# EAGLE design main (EAGLE 8.4.0)
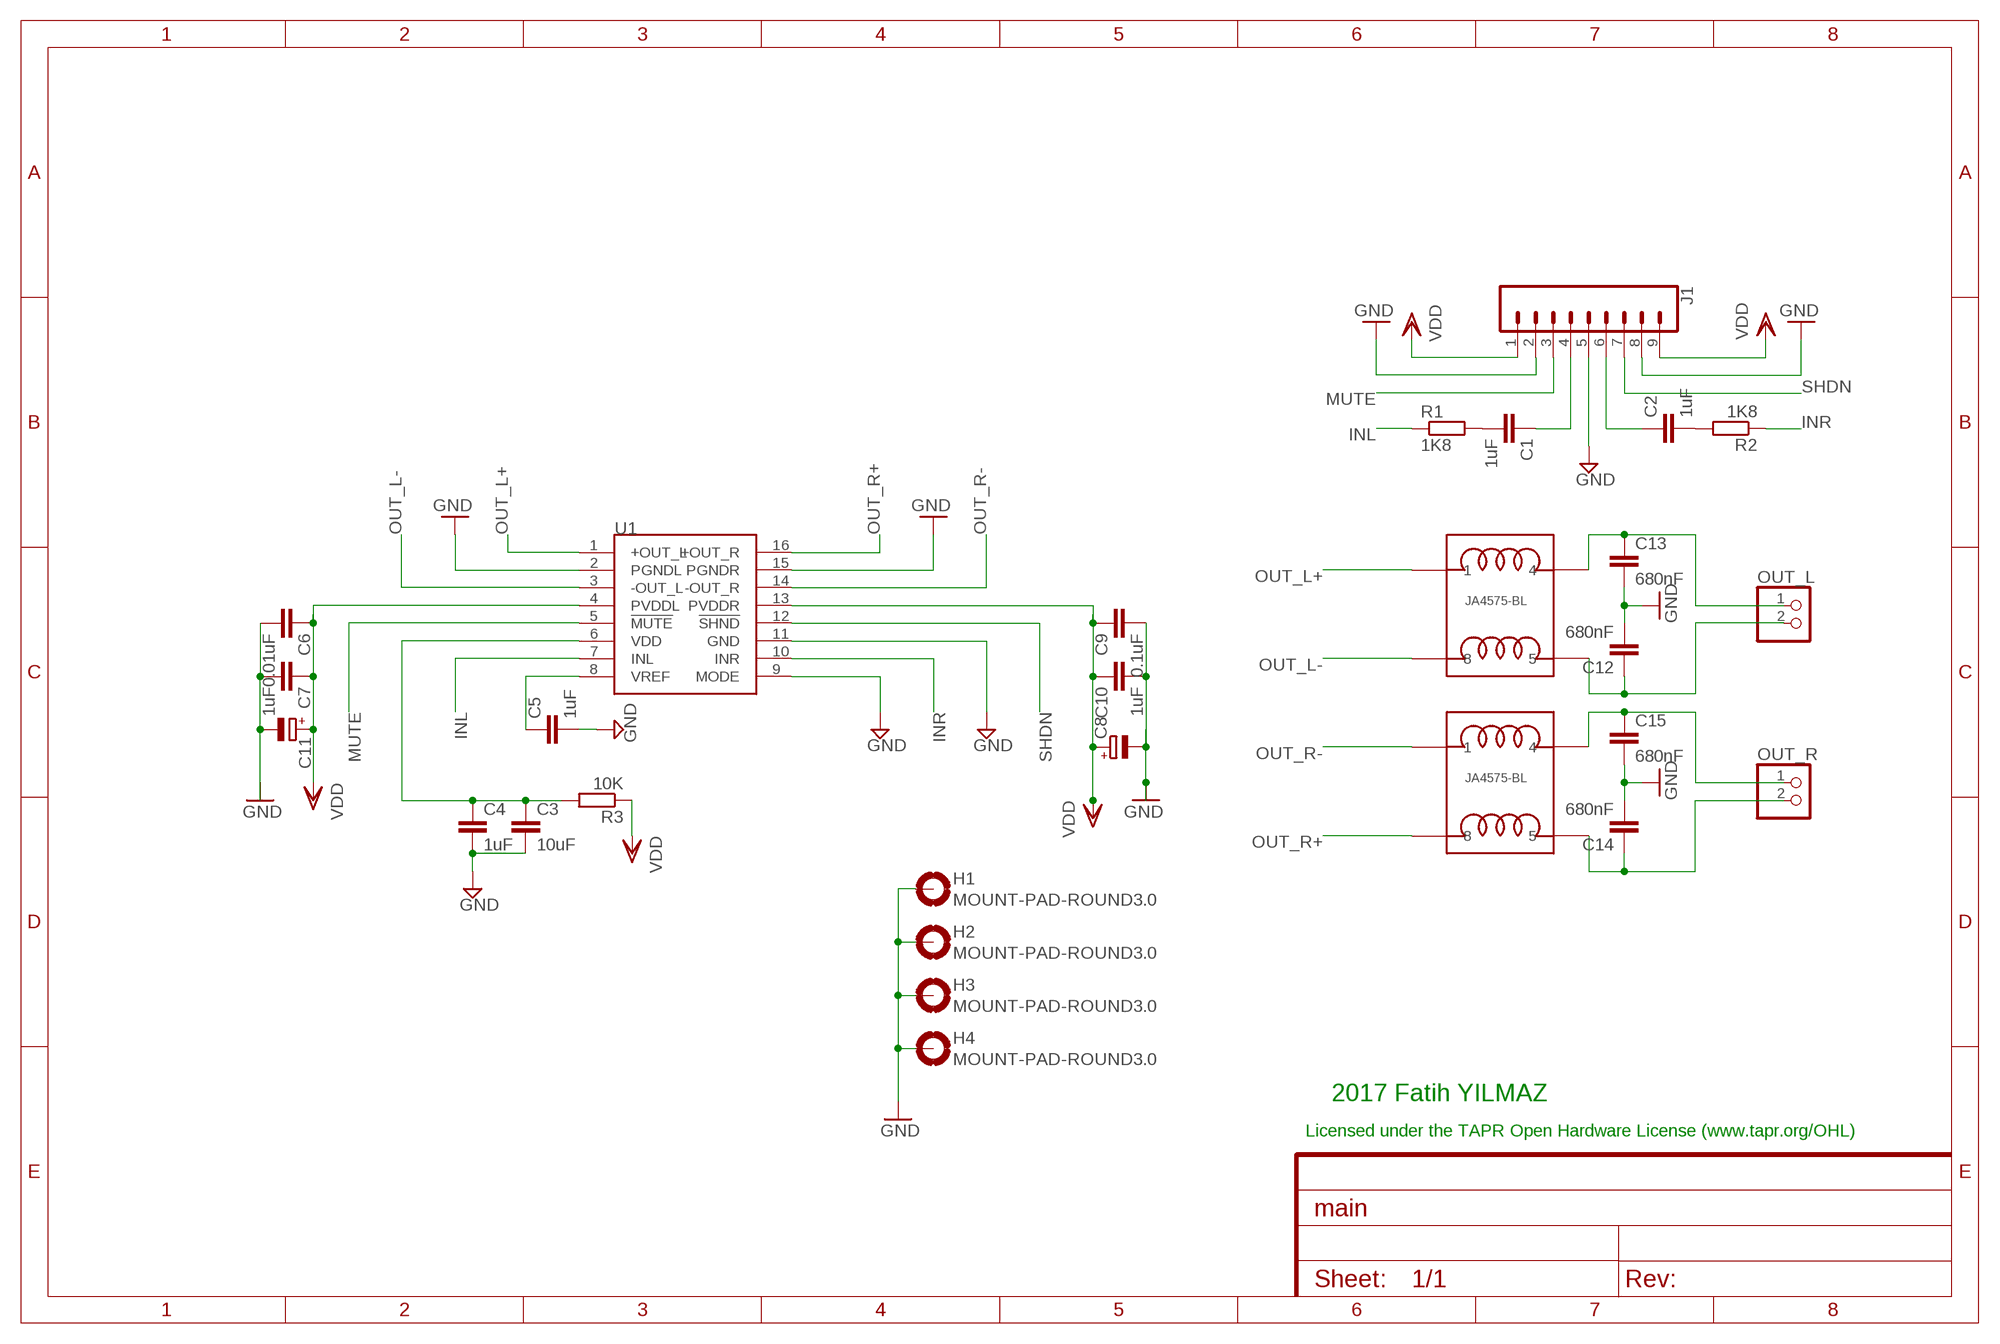
[diagram p0: schematic, sheet 1]
FRAME1 (FRAME-A4L): CNAME: PAM8406_25CM2; CREVISION: REV2; DESIGNER: Fatih YILMAZ

## Parts
C1  1uF  C-EUC1206  [C1206]
C2  1uF  C-EUC1206  [C1206]
C3  10uF  C-EUC1206  [C1206]
C4  1uF  C-EUC1206  [C1206]
C5  1uF  C-EUC1206  [C1206]
C6  0.01uF  C-EUC1206  [C1206]
C7  1uF  C-EUC1206  [C1206]
C8  CPOL-EUE3.5-8  [E3,5-8]
C9  0.1uF  C-EUC1206  [C1206]
C10  1uF  C-EUC1206  [C1206]
C11  CPOL-EUE3.5-8  [E3,5-8]
C12  680nF  C-EU050-045X075  [C050-045X075]
C13  680nF  C-EU050-045X075  [C050-045X075]
C14  680nF  C-EU050-045X075  [C050-045X075]
C15  680nF  C-EU050-045X075  [C050-045X075]
H1  MOUNT-PAD-ROUND3.0  [3,0-PAD]
H2  MOUNT-PAD-ROUND3.0  [3,0-PAD]
H3  MOUNT-PAD-ROUND3.0  [3,0-PAD]
H4  MOUNT-PAD-ROUND3.0  [3,0-PAD]
J1  CONN_09NO_SILK  [1X09_NO_SILK]
LEFT_COIL  JA4575-BL  [JA4575-BL]
OUT_L  PINHD-1X2  [1X02]
OUT_R  PINHD-1X2  [1X02]
R1  1K8  R-EU_R1206  [R1206]
R2  1K8  R-EU_R1206  [R1206]
R3  10K  R-EU_R1206  [R1206]
RIGHT_COIL  JA4575-BL  [JA4575-BL]
U1  PAM8403  [SOP-16]

## Nets
AVDD: C3.1 C4.1 R3.2 U1.6(VDD)
GND: C3.2 C4.2 C5.2 C6.2 C7.2 C8.- C9.2 C10.2 C11.- C12.2 C13.2 C14.2 C15.2 H1.B3,0(MOUNT) H2.B3,0(MOUNT) H3.B3,0(MOUNT) H4.B3,0(MOUNT) J1.2 J1.5 J1.8 U1.2(PGNDL) U1.9(MODE) U1.11(GND) U1.15(PGNDR)
INL: R1.1 U1.7(INL)
INR: R2.1 U1.10(INR)
MUTE: J1.3 U1.5(!MUTE)
N$1: C1.2 R1.2
N$2: C2.2 R2.2
N$3: C1.1 J1.4
N$4: C13.1 LEFT_COIL.4 OUT_L.1
N$5: C2.1 J1.6
N$6: C15.1 OUT_R.1 RIGHT_COIL.4
N$7: C14.1 OUT_R.2 RIGHT_COIL.5
N$8: C12.1 LEFT_COIL.5 OUT_L.2
OUT_L+: LEFT_COIL.1 U1.1(+OUT_L)
OUT_L-: LEFT_COIL.8 U1.3(-OUT_L)
OUT_R+: RIGHT_COIL.8 U1.16(+OUT_R)
OUT_R-: RIGHT_COIL.1 U1.14(-OUT_R)
SHDN: J1.7 U1.12(!SHND)
VDD: C6.1 C7.1 C8.+ C9.1 C10.1 C11.+ J1.1 J1.9 R3.1 U1.4(PVDDL) U1.13(PVDDR)
VREF: C5.1 U1.8(VREF)

## Notes on the sheet
- Ⓒ 2017 Fatih YILMAZ
- Licensed under the TAPR Open Hardware License (www.tapr.org/OHL)

## Library data of the parts
C1 C2 = rcl:C-EU: CAPACITOR, European symbol; MPN: C0603C105K4PACTU
C3-C7 C9 C10 C12-C15 = rcl:C-EU: CAPACITOR, European symbol
C8 C11 = rcl:CPOL-EU: POLARIZED CAPACITOR, European symbol
H1-H4 = holes:MOUNT-PAD-ROUND: MOUNTING PAD, round
J1 = SparkFun-Connectors:CONN_09: Multi connection point. Often used as Generic Header-pin footprint for 0.1 inch spaced/style header connections On any of the 0.1 inch spaced packages, you can populate with these: Break Away Headers - Straight <https://www.sparkfun.com/products/116> (PRT-00116) Break Away Male Headers - Right Angle <https://www.sparkfun.com/products/553> (PRT-00553) Female Headers <https://www.sparkfun.com/products/115> (PRT-00115) Break Away Headers - Machine Pin <https://www.sparkfun.com/products/117> (PRT-00117) Break Away Female Headers - Swiss Machine Pin <https://www.sparkfun.com/products/743> (PRT-00743) For SCREWTERMINALS and SPRING TERMINALS visit here: Screw Terimnals on SparkFun.com <https://www.sparkfun.com/search/results?term=Screw+Terminals> (5mm/3.5mm/2.54mm spacing) This device is also useful as a general connection point to wire up your design to another part of your project. Our various solder wires solder well into these plated through hole pads. Hook-Up Wire - Assortment (Stranded, 22 AWG) <https://www.sparkfun.com/products/11375> (PRT-11375) Hook-Up Wire - Assortment (Solid Core, 22 AWG) <https://www.sparkfun.com/products/11367> (PRT-11367) View the entire wire category on our website here <https://www.sparkfun.com/categories/141> Special notes: Molex polarized connector foot print use with SKU : PRT-08231 with associated crimp pins and housings. 1MM SMD Version SKU: PRT-10208 NOTES ON THE VARIANTS LOCK and LOCK_LONGPADS... This footprint was designed to help hold the alignment of a through-hole component (i.e. 6-pin header) while soldering it into place. You may notice that each hole has been shifted either up or down by 0.005 of an inch from it's more standard position (which is a perfectly straight line). This slight alteration caused the pins (the squares in the middle) to touch the edges of the holes. Because they are alternating, it causes a "brace" to hold the component in place. 0.005 has proven to be the perfect amount of "off-center" position when using our standard breakaway headers. Although looks a little odd when you look at the bare footprint, once you have a header in there, the alteration is very hard to notice. Also,if you push a header all the way into place, it is covered up entirely on the bottom side.
LEFT_COIL RIGHT_COIL = JA4575-BL:JA4575-BL
OUT_L OUT_R = pinhead:PINHD-1X2: PIN HEADER
R1-R3 = rcl:R-EU_: RESISTOR, European symbol
U1 = PAM8403:PAM8403: Dual channel audio amplifier IC - PAM8403

## Board
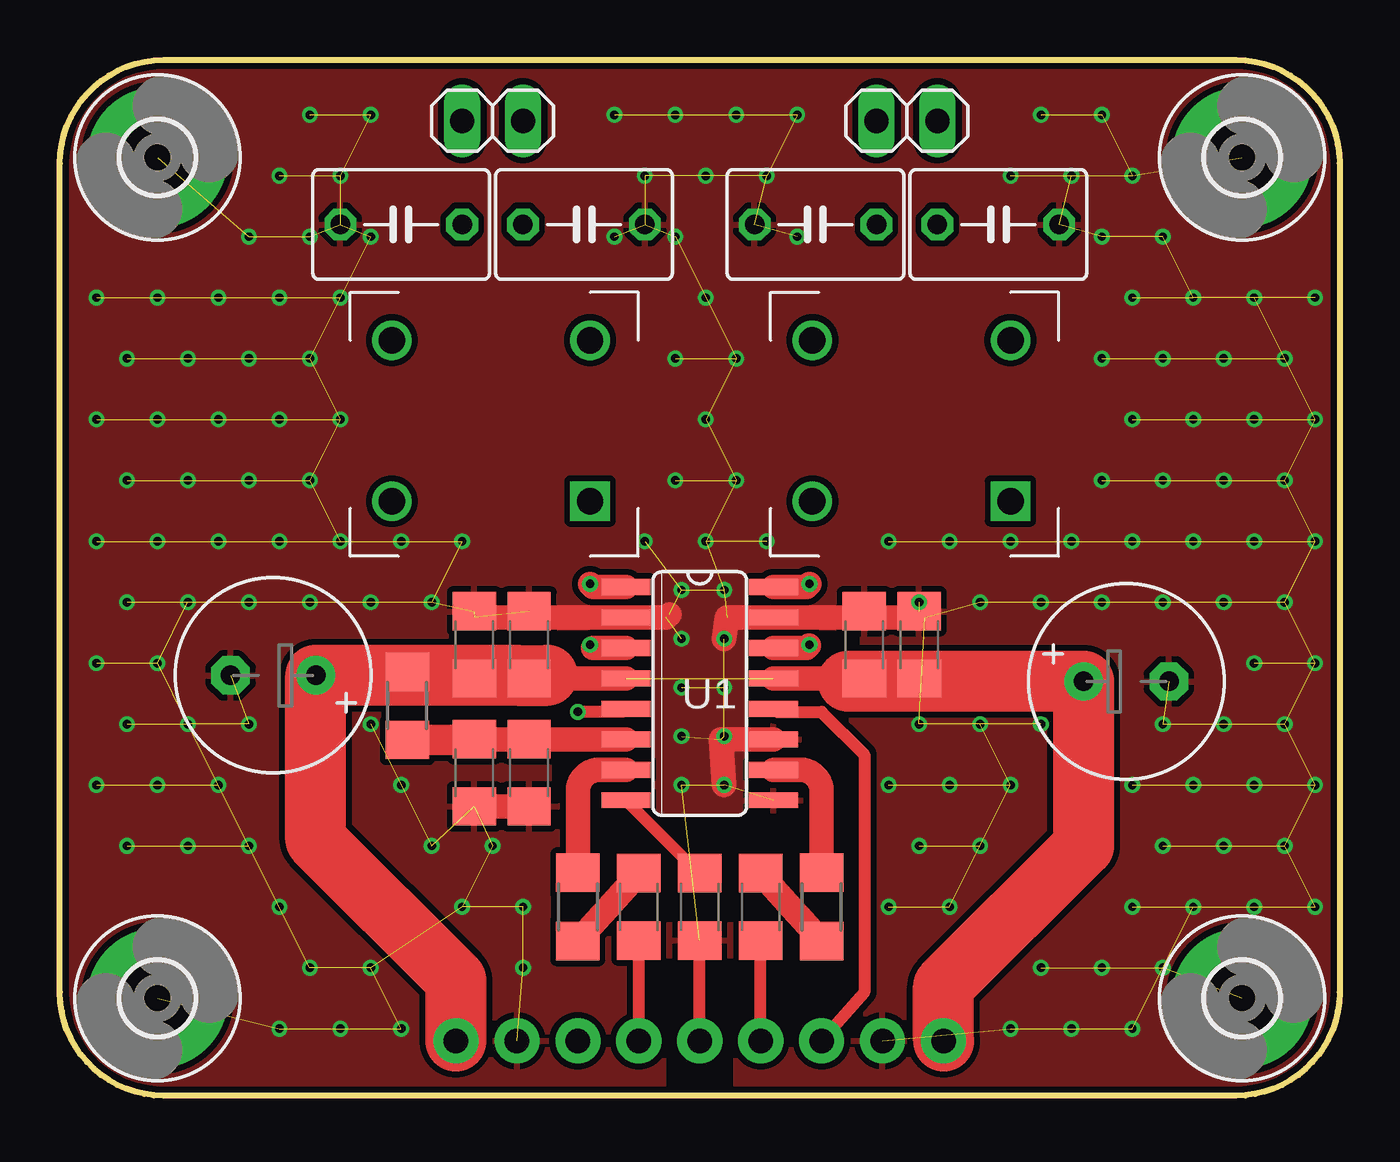
[diagram p1: board, top side]
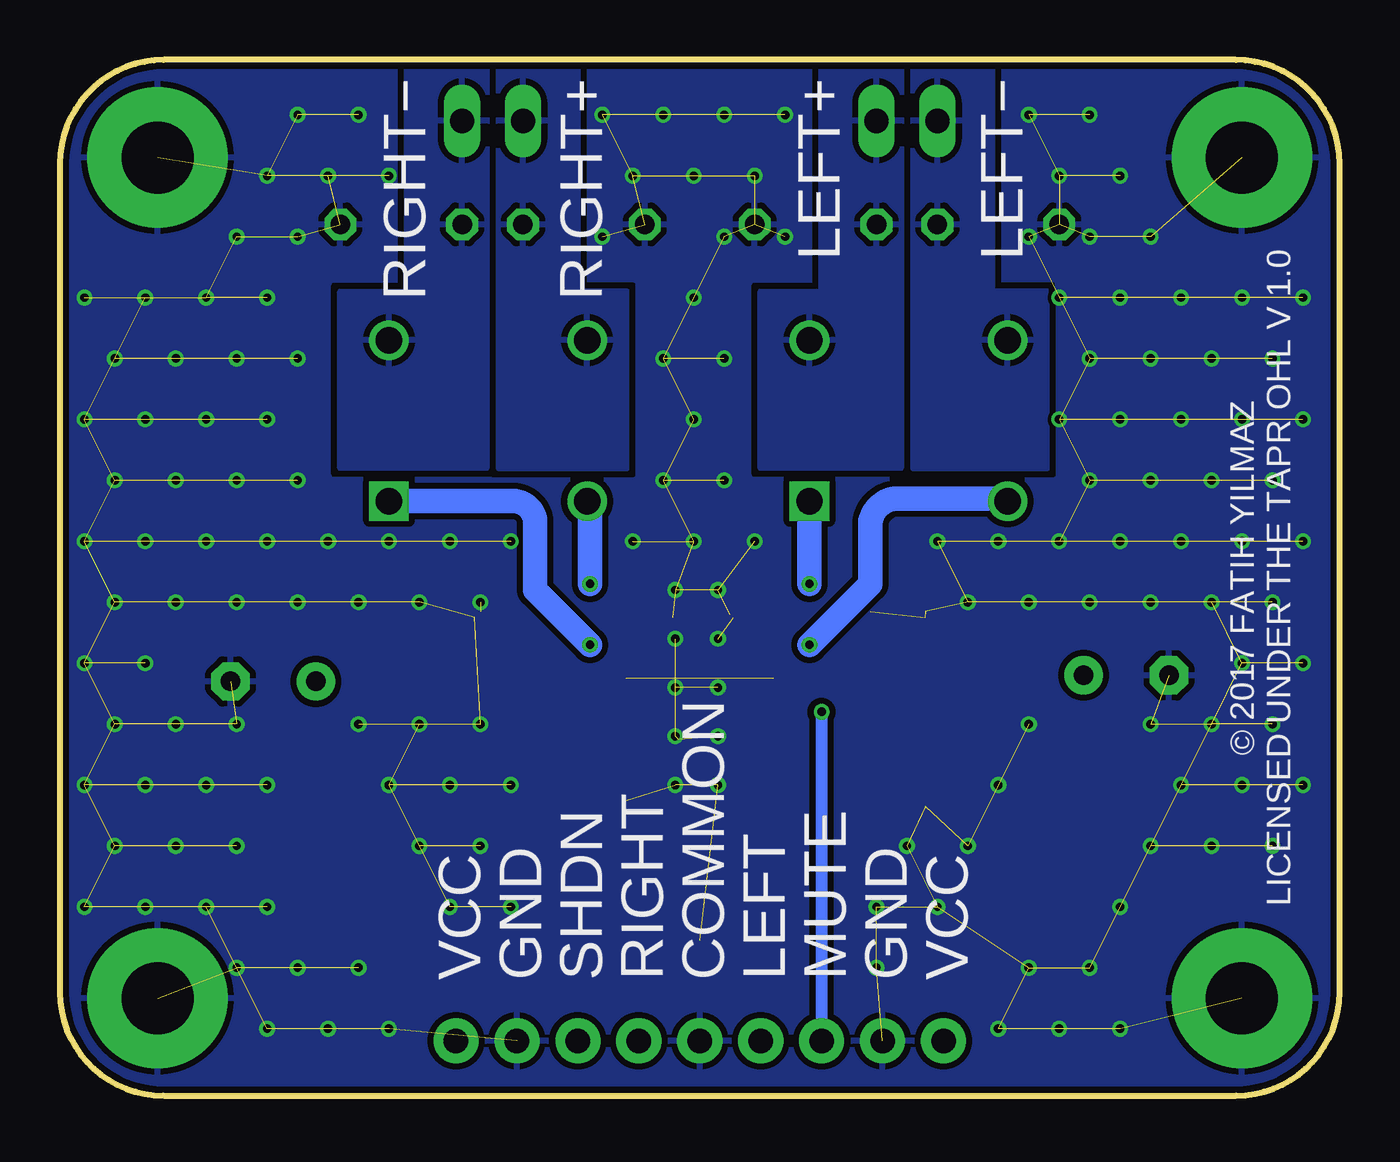
[diagram p2: board, bottom side, seen from below]

Size 53.34 x 43.18 mm. Coordinates in mm from the lower left corner, seen from the top.
Outline: 0,4.32 0,38.86 arc-90 4.32,43.18 49.02,43.18 arc-90 53.34,38.86 53.34,4.32 arc-90 49.02,0 4.32,0 arc-90 0,4.32
Copper layers (1*16): Top 0.035mm / dielectric 1.5mm / Bottom 0.035mm
Design rules "SeeedStudio_2layer_DRU_no_angle_20140221": minimum track width 6mil, minimum drill 12mil, track to track 6mil, track to pad 6mil, pad to pad 6mil, via to via 6mil, smd to smd 0mil, copper to edge 10mil, drill to drill 10mil, minimum pad ring 10mil, minimum via ring 6mil, stop-mask expansion 2mil, vias tented up to drill 100mil, thermal gap 10mil

### Footprints (pad centres in the part's own frame; a part is rotated, then mirrored left to right if it is on the bottom)
C1206 = smd 1.6 x 1.8: 1 -1.4,0; 2 1.4,0
E3,5-8 = drill 0.813 pad 1.6: + -1.778,0 | drill 0.813 pad 1.6 octagon: - 1.778,0
C050-045X075 = drill 0.813 octagon: 1 -2.54,0; 2 2.54,0
3,0-PAD = drill 3 pad 5.842: B3,0 0,0
1X09_NO_SILK = drill 1.016 pad 1.88: 1 0,0; 2 2.54,0; 3 5.08,0; 4 7.62,0; 5 10.16,0; 6 12.7,0; 7 15.24,0; 8 17.78,0; 9 20.32,0
JA4575-BL = drill 1.1 square: 1 0,6.71 | drill 1.1: 4 0,0; 5 8.26,0; 8 8.26,6.71
1X02 = drill 1.016 long: 1 -1.27,0; 2 1.27,0
R1206 = smd 1.6 x 1.803: 1 -1.422,0; 2 1.422,0
SOP-16 = smd 0.66 x 2.032: 1 -4.445,-3.073; 2 -3.175,-3.073; 3 -1.905,-3.073; 4 -0.635,-3.073; 5 0.635,-3.073; 6 1.905,-3.073; 7 3.175,-3.073; 8 4.445,-3.073; 9 4.445,3.073; 10 3.175,3.073; 11 1.905,3.073; 12 0.635,3.073; 13 -0.635,3.073; 14 -1.905,3.073; 15 -3.175,3.073; 16 -4.445,3.073

### Placement (x,y rotation side)
C1  24.13,7.87 90 top
C2  29.21,7.87 90 top
C3  17.27,13.46 270 top
C4  19.56,13.46 270 top
C5  26.67,7.87 270 top
C6  17.27,18.8 90 top
C7  19.56,18.8 90 top
C8  44.45,17.27 0 top
C9  33.53,18.8 90 top
C10  35.81,18.8 90 top
C11  8.89,17.53 180 top
C12  14.22,36.32 180 top
C13  21.84,36.32 0 top
C14  31.5,36.32 180 top
C15  39.12,36.32 0 top
H1  49.28,4.06 0 top
H2  49.28,39.12 0 top
H3  4.06,39.12 0 top
H4  4.06,4.06 0 top
J1  16.51,2.29 0 top
LEFT_COIL  22.1,31.5 180 top
OUT_L  18.03,40.64 180 top
OUT_R  35.31,40.64 180 top
R1  21.59,7.87 270 top
R2  31.75,7.87 270 top
R3  14.48,16.26 270 top
RIGHT_COIL  39.62,31.5 180 top
U1  26.67,16.76 270 top

### Tracks (layer width: path | path; a pad name or v marks a point on that pad's centre or on a via)
AVDD
  Top 1.016: U1.6 C4.1 C3.1 17,14.88
  Top 1.27: C3.1 17.27,14.83 R3.2
GND  (via drill 0.35)  (178 unrouted)
  Top 0.508: J1.5 C5.2
  Top 1.016: 17.27,19.94 U1.2 25.27,19.94 25.4,20.07 | 33.53,19.94 U1.15 27.81,19.94 v27.69,19.05 | 33.53,19.94 36.07,19.94 C10.2 | C9.2 33.78,20.19 33.53,19.94 | U1.11 27.56,14.86 v27.69,12.95 | C4.2 C3.2
  other vias: 25.91,21.08 27.69,21.08 25.91,19.05 25.91,17.02 27.69,17.02 25.91,14.99 27.69,14.99 25.91,12.95 1.52,12.95 1.52,18.03 1.52,23.11 1.52,28.19 1.52,33.27 2.79,10.41 4.06,12.95 2.79,15.49 4.06,18.03 2.79,20.57 4.06,23.11 2.79,25.65 4.06,28.19 2.79,30.73 4.06,33.27 5.33,10.41 6.6,12.95 5.33,15.49 5.33,20.57 6.6,23.11 5.33,25.65 6.6,28.19 5.33,30.73 6.6,33.27 9.14,2.79 9.14,7.87 7.87,10.41 7.87,15.49 7.87,20.57 9.14,23.11 7.87,25.65 9.14,28.19 7.87,30.73 9.14,33.27 7.87,35.81 9.14,38.35 11.68,2.79 10.41,5.33 10.41,20.57 11.68,23.11 10.41,25.65 11.68,28.19 10.41,30.73 11.68,33.27 10.41,35.81 11.68,38.35 10.41,40.89 14.22,2.79 12.95,5.33 14.22,12.95 12.95,15.49 12.95,20.57 14.22,23.11 12.95,35.81 12.95,40.89 16.76,7.87 15.49,10.41 15.49,20.57 16.76,23.11 19.3,5.33 19.3,7.87 18.03,10.41 24.38,23.11 23.11,35.81 24.38,38.35 23.11,40.89 26.92,23.11 25.65,25.65 26.92,28.19 25.65,30.73 26.92,33.27 25.65,35.81 26.92,38.35 25.65,40.89 29.46,23.11 28.19,25.65 28.19,30.73 29.46,38.35 28.19,40.89 30.73,35.81 30.73,40.89 34.54,7.87 34.54,12.95 34.54,23.11 37.08,7.87 35.81,10.41 37.08,12.95 35.81,15.49 35.81,20.57 37.08,23.11 39.62,2.79 38.35,10.41 39.62,12.95 38.35,15.49 38.35,20.57 39.62,23.11 39.62,38.35 42.16,2.79 40.89,5.33 40.89,15.49 40.89,20.57 42.16,23.11 42.16,38.35 40.89,40.89 44.7,2.79 43.43,5.33 44.7,7.87 44.7,12.95 43.43,20.57 44.7,23.11 43.43,25.65 44.7,28.19 43.43,30.73 44.7,33.27 43.43,35.81 44.7,38.35 43.43,40.89 45.97,5.33 47.24,7.87 45.97,10.41 47.24,12.95 45.97,15.49 45.97,20.57 47.24,23.11 45.97,25.65 47.24,28.19 45.97,30.73 47.24,33.27 45.97,35.81 49.78,7.87 48.51,10.41 49.78,12.95 48.51,15.49 49.78,18.03 48.51,20.57 49.78,23.11 48.51,25.65 49.78,28.19 48.51,30.73 49.78,33.27 52.32,7.87 51.05,10.41 52.32,12.95 51.05,15.49 52.32,18.03 51.05,20.57 52.32,23.11 51.05,25.65 52.32,28.19 51.05,30.73 52.32,33.27
  pour Bottom (isolate 0.254, rank 6): 0,0 53.34,0 53.34,43.18 0,43.18
  pour Top: 28.45,14.22 24.89,14.22 24.89,21.84 28.45,21.84
  pour Top (isolate 0.254, rank 6): 0,0 53.34,0 53.34,43.18 0,43.18
INL
  Top 1.016: U1.7 22.48,13.59 arc90 21.59,12.7 R1.1
INR
  Top 1.016: U1.10 30.86,13.59 arc-90 31.75,12.7 R2.1
MUTE  (via drill 0.35)
  Top 0.508: U1.5 23.47,16 v21.59,16
  Bottom 0.508: v21.59,16 J1.3
N$1
  Top 1.016: R1.2 22.57,7.54 22.57,7.55 22.63,7.61 C1.2
N$2
  Top 1.016: C2.2 30.71,7.61 30.77,7.55 30.77,7.54 R2.2
N$3
  Top 0.508: 24.13,6.35 C1.1 J1.4
N$4
  pour Bottom: 18.29,43.18 18.29,26.16 24.13,26.16 24.13,33.53 21.59,33.53 21.59,43.18
N$5
  Top 0.508: J1.6 C2.1
N$6
  pour Bottom: 35.56,26.16 41.66,26.16 41.66,33.53 38.86,33.53 38.86,43.18 35.56,43.18
N$7
  pour Bottom: 35.05,43.18 35.05,26.16 29.72,26.16 29.72,33.53 31.75,33.53 31.75,43.18
N$8
  pour Bottom: 17.78,26.16 12.19,26.16 12.19,33.53 14.48,33.53 14.48,43.18 17.78,43.18
N$10
  cutout Top: 32.77,7.37 32.77,8.38 20.57,8.38 20.57,7.37
N$11
  cutout Top: 25.4,0 25.4,5.59 27.94,5.59 27.94,0
N$12
  cutout Top: 25.15,11.68 31.24,11.68 31.24,10.41 26.16,10.41
N$13
  cutout Top: 20.83,15.49 20.83,16.51 13.46,16.51 13.46,15.49
N$14
  cutout Top: 30.99,15.49 30.99,14.22 31.24,14.22 arc-90 32.51,12.95 32.51,10.16 33.02,10.16 33.02,13.97 31.5,15.49
N$15
  cutout Top: 21.59,18.03 21.59,18.8 22.1,19.3 16.76,19.3 16.76,18.8 20.32,18.8 21.08,18.03
N$16
  cutout Top: 20.57,12.45 20.57,14.22 21.59,14.22 21.08,13.72 21.08,13.21 21.08,12.45
N$17
  cutout Top: 31.75,19.3 33.27,19.3 33.27,18.54 33.27,18.8 33.02,18.54 32.51,18.54 32.26,18.29 31.75,18.29
OUT_L+  (via drill 0.35)
  Top 1.016: U1.1 22.22,21.21 v22.1,21.34
  Bottom 1.016: v22.1,21.34 LEFT_COIL.1
OUT_L-  (via drill 0.35)
  Top 0.508: 22.22,18.67 v22.1,18.8
  Top 1.016: U1.3 22.22,18.67
  Bottom 1.016: v22.1,18.8 19.56,21.34 19.56,23.62 arc90 18.54,24.89 13.99,24.89 LEFT_COIL.8
OUT_R+  (via drill 0.35)
  Top 1.016: U1.16 31.11,21.21 v31.24,21.34
  Bottom 1.016: v31.24,21.34 31.24,24.66 RIGHT_COIL.8
OUT_R-  (via drill 0.35)
  Top 0.508: U1.14 29.87,18.8 v31.24,18.8
  Top 1.016: U1.14 31.11,18.67 31.22,18.77
  Bottom 1.016: v31.24,18.8 33.53,21.08 33.53,23.88 arc-90 34.44,24.79 RIGHT_COIL.1
SHDN
  Top 0.508: U1.12 29.87,16 31.75,16 33.53,14.22 33.53,4.32 J1.7
VDD  (1 unrouted)
  Top 1.016: 21.21,17.4 U1.4 C7.1 | 21.21,17.4 21.08,17.53 | 21.21,17.4 C7.1 | 21.21,17.4 | 20.32,17.53 21.08,17.53 21.21,17.4 | C7.1 19.18,17.4 19.05,17.53 | R3.1 16.99,17.68 C6.1 C7.1 | U1.13 32.72,17.4 32.85,17.27 | C9.1 34.17,17.4 34.29,17.27 | C10.1 35.68,17.4 35.56,17.27
  Top 2.54: J1.1 16.51,4.83 10.67,10.67 C11.+ 19.05,17.53 20.32,17.53 | 32.85,17.27 34.29,17.27 35.56,17.27 C8.+ 42.67,10.41 36.83,4.57 J1.9
VREF
  Top 0.508: C5.1 26.64,9.27 U1.8

### Text on the board
bPlace: LEFT− | LEFT+ | RIGHT+ | RIGHT− | © 2017 FATIH YILMAZ / LICENSED UNDER THE TAPR OHL V 1.0 | VCC | GND | MUTE | LEFT | COMMON | RIGHT | SHDN | GND | VCC